# EAGLE design ICS43432_pi_stereo_0.1 (EAGLE 7.6.0)
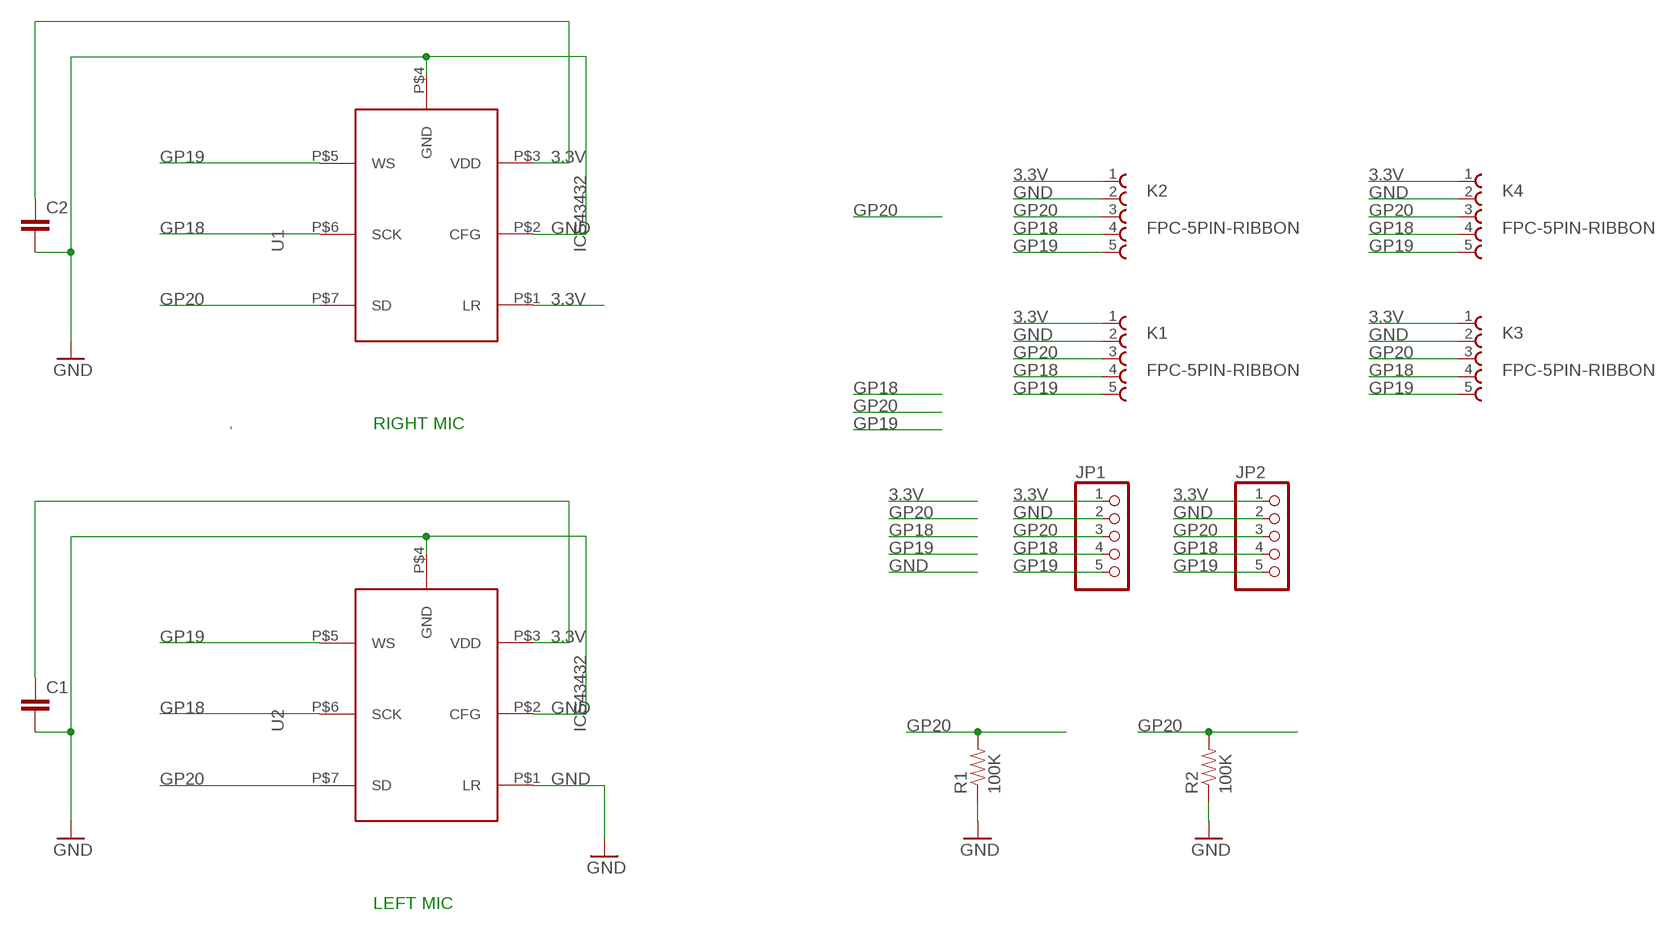
[diagram p0: schematic, sheet 1]

## Parts
C1  CAP0402-CAP  [0402-CAP]
C2  CAP0402-CAP  [0402-CAP]
JP1  HEADER-1X5ROUND  [1X05_ROUND]
JP2  HEADER-1X5ROUND  [1X05_ROUND]
K1  FPC-5PIN-RIBBON  [5PIN_FPC]
K2  FPC-5PIN-RIBBON  [5PIN_FPC]
K3  FPC-5PIN-RIBBON  [5PIN_FPC]
K4  FPC-5PIN-RIBBON  [5PIN_FPC]
R1  100K  RESISTOR0402  [0402-RES]
R2  100K  RESISTOR0402  [0402-RES]
U1  ICS43432  [ICS43432]
U2  ICS43432  [ICS43432]

## Nets
3.3V: C1.1 C2.1 JP1.1 JP2.1 K1.1 K2.1 K3.1 K4.1 U1.P$1(LR) U1.P$3(VDD) U2.P$3(VDD)
GND: C1.2 C2.2 JP1.2 JP2.2 K1.2 K2.2 K3.2 K4.2 R1.1 R2.1 U1.P$2(CFG) U1.P$4(GND) U2.P$1(LR) U2.P$2(CFG) U2.P$4(GND)
GP18: JP1.4 JP2.4 K1.4 K2.4 K3.4 K4.4 U1.P$6(SCK) U2.P$6(SCK)
GP19: JP1.5 JP2.5 K1.5 K2.5 K3.5 K4.5 U1.P$5(WS) U2.P$5(WS)
GP20: JP1.3 JP2.3 K1.3 K2.3 K3.3 K4.3 R1.2 R2.2 U1.P$7(SD) U2.P$7(SD)

## Notes on the sheet
- RIGHT MIC
- LEFT MIC

## Library data of the parts
C1 C2 = SparkFun-Capacitors:CAP: Capacitor Standard 0603 ceramic capacitor, and 0.1" leaded capacitor.
JP1 JP2 = microbuilder:HEADER-1X5: PIN HEADER
K1-K4 = twomey:FPC-5PIN-RIBBON: FPC 1.00mm Ribbon 6 pos
R1 R2 = SparkFun-Resistors:RESISTOR: Resistor Basic schematic elements and footprints for 0603, 1206, and PTH resistors.
U1 U2 = Kris:ICS43432

## Net classes
0 default: clearance 0.205 mm

## Board
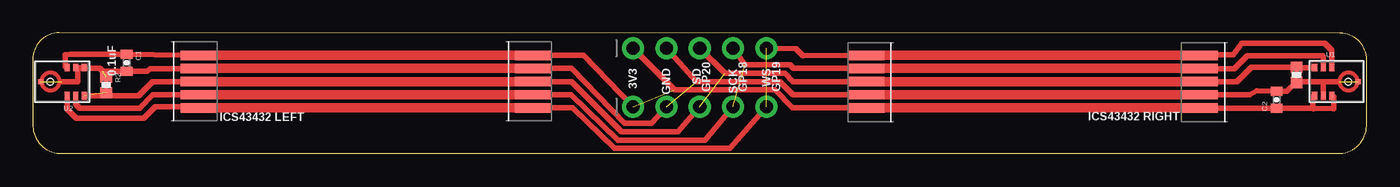
[diagram p1: board, top side]

Size 101.61 x 9.18 mm. Coordinates in mm from the lower left corner, seen from the top.
Outline: 99.57,9.14 2,9.18 arc90 0,7.18 0,2.25 arc90 2,0 99.6,0 arc90 101.6,2.25 101.6,7.14 arc90 99.6,9.14
Copper layers (1*16): Top 0.035mm / dielectric 1.5mm / Bottom 0.035mm
Design rules "default *": minimum track width 8mil, minimum drill 24mil, track to track 4mil, track to pad 4mil, pad to pad 8mil, via to via 8mil, smd to smd 8mil, copper to edge 12mil, drill to drill 8mil, minimum pad ring 10mil, minimum via ring 8mil, stop-mask expansion 4mil, vias tented up to drill 0mil, thermal gap 10mil

### Footprints (pad centres in the part's own frame; a part is rotated, then mirrored left to right if it is on the bottom)
0402-CAP = smd 0.7 x 0.9: 1 -0.65,0; 2 0.65,0
1X05_ROUND = drill 1 pad 1.676: 1 -5.08,0; 2 -2.54,0; 3 0,0; 4 2.54,0; 5 5.08,0
5PIN_FPC = smd 0.711 x 2.794: 1 -2,0.02; 2 -1,0.02; 3 0,0.02; 4 1,0.02; 5 2,0.02
0402-RES = smd 0.85 x 0.9: 1 -0.58,0; 2 0.58,0
ICS43432 = smd 0.4 x 0.6: P$1 -1.675,-1.075; P$2 -1.025,-1.075; P$3 -0.375,-1.075; P$5 -0.375,1.075; P$6 -1.025,1.075; P$7 -1.675,1.075 | smd 0.4 x 0.4: P$4 1.62,0 | hole 0.5: 0.9,0

### Placement (x,y rotation side)
C1  7.15,6.9 270 top
C2  94.74,4.09 90 top
JP1  50.8,3.56 0 top
JP2  50.8,8 0 top
K1  12.63,5.46 270 top
K2  88.9,5.46 90 top
K3  38.1,5.46 270 top
K4  63.5,5.46 90 top
R1  96.27,5.97 90 top
R2  5.59,5.21 270 top
U1  99.32,5.46 0 top
U2  2.24,5.46 180 top

### Tracks (layer width: path | path; a pad name or v marks a point on that pad's centre or on a via)
3.3V  (1 unrouted)
  Top 0.406: K1.1 11.33,7.45 C1.1 2.88,7.55 2.47,7.52 2.47,6.59 U2.P$3 | U1.P$1 97.49,4.29 97.49,3.43 | 94.91,3.43 C2.1 | U1.P$3 99.09,4.31 99.09,3.4 97.49,3.43 | 97.49,3.43 97.54,3.4 97.28,3.43 94.75,3.43 C2.1 | C2.1 88.9,3.44 K2.1 | JP2.1 48.9,4.83 56.52,4.83 57.88,3.46 K4.1 | JP1.1 41.94,7.46 K3.1
  Top 0.711: K1.1 K3.1 | K2.1 K4.1
GND  (4 unrouted)
  Top 0.406: K1.2 11.28,6.45 8.94,6.45 8.72,6.25 C1.2 5.31,6.25 5.08,6.48 3.46,6.48 U2.P$1 U2.P$2 3.43,6.49 3.43,5.46 2.21,5.46 | 96.27,5.46 95.52,4.74 C2.2 93.25,4.75 92.71,4.45 89.04,4.46 K2.2 | 96.27,5.46 98.3,5.46 | 98.3,5.46 99.32,5.46 99.47,5.44 | U1.P$2 98.29,5.45 98.3,5.46 | JP2.2 50.55,5.46 56.9,5.46 57.9,4.46 K4.2 | JP1.2 47.12,2.29 45.09,2.29 41.04,6.46 K3.2 | R1.1 96.27,5.46
  Top 0.711: K1.2 K3.2 | K2.2 K4.2
GP18  (1 unrouted)
  Top 0.406: U2.P$6 3.26,3.73 3.56,3.43 8.13,3.43 9.15,4.45 11.36,4.45 K1.4 | U1.P$6 98.29,7.31 98.28,7.44 92.51,7.44 91.52,6.45 88.92,6.43 K2.4 | JP2.4 54.23,6.73 57.66,6.73 57.93,6.46 K4.4 | JP1.4 51.18,1.02 44.58,1.02 41.01,4.46 K3.4
  Top 0.711: K1.4 K3.4 | K2.4 K4.4
GP19  (1 unrouted)
  Top 0.406: U2.P$5 2.61,3.36 3.3,2.67 8.44,2.67 9.32,3.56 11.35,3.56 K1.5 | U1.P$5 98.94,7.87 98.43,8.38 92.08,8.38 91.44,7.49 88.91,7.49 K2.5 | JP1.5 53.09,0.38 44.33,0.38 41.12,3.46 K3.5 | K4.5 58.68,7.44 58.14,7.98 JP2.5
  Top 0.711: K1.5 K3.5 | K2.5 K4.5
GP20  (2 unrouted)
  Top 0.406: U2.P$7 8.07,4.39 9.15,5.46 K1.3 | K2.3 91.7,5.46 92.77,6.54 92.77,6.55 R1.2 96.27,6.54 U1.P$7 | JP2.3 52.71,6.1 57.28,6.1 57.91,5.46 K4.3 | JP1.3 49.15,1.65 44.83,1.65 41.02,5.46 K3.3
  Top 0.711: K1.3 K3.3 | K2.3 K4.3

### Text on the board
tPlace: GP20 | GP18 | GP19 | 0.1uF | 3V3 | GND | SD | SCK | WS | ICS43432 RIGHT | ICS43432 LEFT